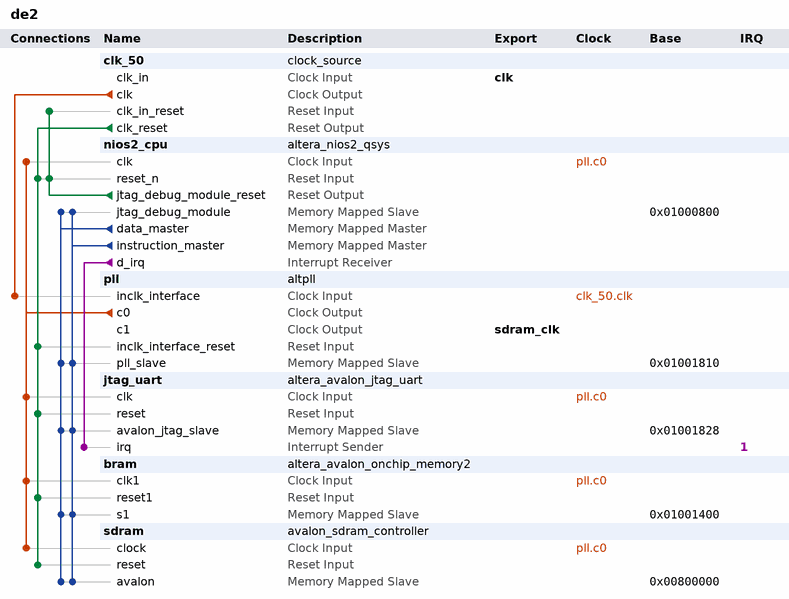
[diagram p0: system contents]
# Platform Designer (Qsys) system de2, Cyclone II EP2C35F672C7
# Parameters at their usual value, and those the tool derives, are not listed.
package require -exact qsys 13.0
create_system de2
set_project_property DEVICE_FAMILY {Cyclone II}
set_project_property DEVICE EP2C35F672C7

add_instance clk_50 clock_source 13.0
set_instance_parameter_value clk_50 clockFrequency 50000000

add_instance nios2_cpu altera_nios2_qsys 13.0
set_instance_parameter_value nios2_cpu resetSlave bram.s1
set_instance_parameter_value nios2_cpu mmu_TLBMissExcSlave None
set_instance_parameter_value nios2_cpu exceptionSlave bram.s1
set_instance_parameter_value nios2_cpu breakSlave nios2_cpu.jtag_debug_module
set_instance_parameter_value nios2_cpu impl Tiny
set_instance_parameter_value nios2_cpu icache_size 4096

add_instance pll altpll 13.0
set_instance_parameter_value pll INCLK0_INPUT_FREQUENCY 20000
set_instance_parameter_value pll GATE_LOCK_SIGNAL NO
set_instance_parameter_value pll VALID_LOCK_MULTIPLIER 1
set_instance_parameter_value pll INVALID_LOCK_MULTIPLIER 5
set_instance_parameter_value pll CLK0_MULTIPLY_BY 2
set_instance_parameter_value pll CLK1_MULTIPLY_BY 2
set_instance_parameter_value pll CLK0_DIVIDE_BY 1
set_instance_parameter_value pll CLK1_DIVIDE_BY 1
set_instance_parameter_value pll CLK1_PHASE_SHIFT -3000
set_instance_parameter_value pll CLK1_DUTY_CYCLE 50
set_instance_parameter_value pll PORT_clk1 PORT_USED
set_instance_parameter_value pll PORT_clk2 PORT_UNUSED
set_instance_parameter_value pll PORT_clk3 PORT_UNUSED
set_instance_parameter_value pll PORT_ARESET PORT_UNUSED
set_instance_parameter_value pll PORT_LOCKED PORT_UNUSED

add_instance jtag_uart altera_avalon_jtag_uart 13.0.1.99.2
set_instance_parameter_value jtag_uart simInteractiveOptions NO_INTERACTIVE_WINDOWS

add_instance bram altera_avalon_onchip_memory2 13.0.1.99.2
set_instance_parameter_value bram dataWidth 32
set_instance_parameter_value bram dualPort false
set_instance_parameter_value bram initMemContent false
set_instance_parameter_value bram initializationFileName onchip_mem.hex
set_instance_parameter_value bram memorySize 1024

add_instance sdram avalon_sdram_controller 1.0
set_instance_parameter_value sdram tRAS 40
set_instance_parameter_value sdram SDRAM_BA 2
set_instance_parameter_value sdram tRFC 55
set_instance_parameter_value sdram AVS_DW 16
set_instance_parameter_value sdram SDRAM_COL 8
set_instance_parameter_value sdram tRP 15
set_instance_parameter_value sdram tREF 64
set_instance_parameter_value sdram WRITE_FIFO_SIZE 4
set_instance_parameter_value sdram SDRAM_BANK 4
set_instance_parameter_value sdram CMD_FIFO_SIZE 4
set_instance_parameter_value sdram SDRAM_BL 1
set_instance_parameter_value sdram SDRAM_DATA 16
set_instance_parameter_value sdram tRCD 15
set_instance_parameter_value sdram AVS_AW 23
set_instance_parameter_value sdram READ_FIFO_SIZE 4
set_instance_parameter_value sdram tINIT 100
set_instance_parameter_value sdram CLK_PERIOD 10
set_instance_parameter_value sdram INIT_REF_CNT 2
set_instance_parameter_value sdram tRRD 10
set_instance_parameter_value sdram SDRAM_ROW 12
set_instance_parameter_value sdram tRC 55
set_instance_parameter_value sdram CL 2

# connections
add_connection clk_50.clk pll.inclk_interface clock
add_connection pll.c0 bram.clk1 clock
add_connection pll.c0 jtag_uart.clk clock
add_connection pll.c0 nios2_cpu.clk clock
add_connection pll.c0 sdram.clock clock
add_connection clk_50.clk_reset bram.reset1 reset
add_connection clk_50.clk_reset jtag_uart.reset reset
add_connection clk_50.clk_reset nios2_cpu.reset_n reset
add_connection clk_50.clk_reset pll.inclk_interface_reset reset
add_connection clk_50.clk_reset sdram.reset reset
add_connection nios2_cpu.jtag_debug_module_reset clk_50.clk_in_reset reset
add_connection nios2_cpu.jtag_debug_module_reset nios2_cpu.reset_n reset
add_connection nios2_cpu.data_master bram.s1 avalon
set_connection_parameter_value nios2_cpu.data_master/bram.s1 baseAddress 0x01001400
add_connection nios2_cpu.data_master jtag_uart.avalon_jtag_slave avalon
set_connection_parameter_value nios2_cpu.data_master/jtag_uart.avalon_jtag_slave baseAddress 0x01001828
add_connection nios2_cpu.data_master nios2_cpu.jtag_debug_module avalon
set_connection_parameter_value nios2_cpu.data_master/nios2_cpu.jtag_debug_module baseAddress 0x01000800
add_connection nios2_cpu.data_master pll.pll_slave avalon
set_connection_parameter_value nios2_cpu.data_master/pll.pll_slave baseAddress 0x01001810
add_connection nios2_cpu.data_master sdram.avalon avalon
set_connection_parameter_value nios2_cpu.data_master/sdram.avalon baseAddress 0x00800000
add_connection nios2_cpu.instruction_master bram.s1 avalon
set_connection_parameter_value nios2_cpu.instruction_master/bram.s1 baseAddress 0x01001400
add_connection nios2_cpu.instruction_master jtag_uart.avalon_jtag_slave avalon
set_connection_parameter_value nios2_cpu.instruction_master/jtag_uart.avalon_jtag_slave baseAddress 0x01001828
add_connection nios2_cpu.instruction_master nios2_cpu.jtag_debug_module avalon
set_connection_parameter_value nios2_cpu.instruction_master/nios2_cpu.jtag_debug_module baseAddress 0x01000800
add_connection nios2_cpu.instruction_master pll.pll_slave avalon
set_connection_parameter_value nios2_cpu.instruction_master/pll.pll_slave baseAddress 0x01001810
add_connection nios2_cpu.instruction_master sdram.avalon avalon
set_connection_parameter_value nios2_cpu.instruction_master/sdram.avalon baseAddress 0x00800000
add_connection nios2_cpu.d_irq jtag_uart.irq interrupt
set_connection_parameter_value nios2_cpu.d_irq/jtag_uart.irq irqNumber 1

# exported interfaces
add_interface clk clock sink
set_interface_property clk EXPORT_OF clk_50.clk_in
add_interface sdram_clk clock source
set_interface_property sdram_clk EXPORT_OF pll.c1

set_interconnect_requirement {$system} qsys_mm.clockCrossingAdapter HANDSHAKE
set_interconnect_requirement {$system} qsys_mm.maxAdditionalLatency 1

save_system de2.qsys
